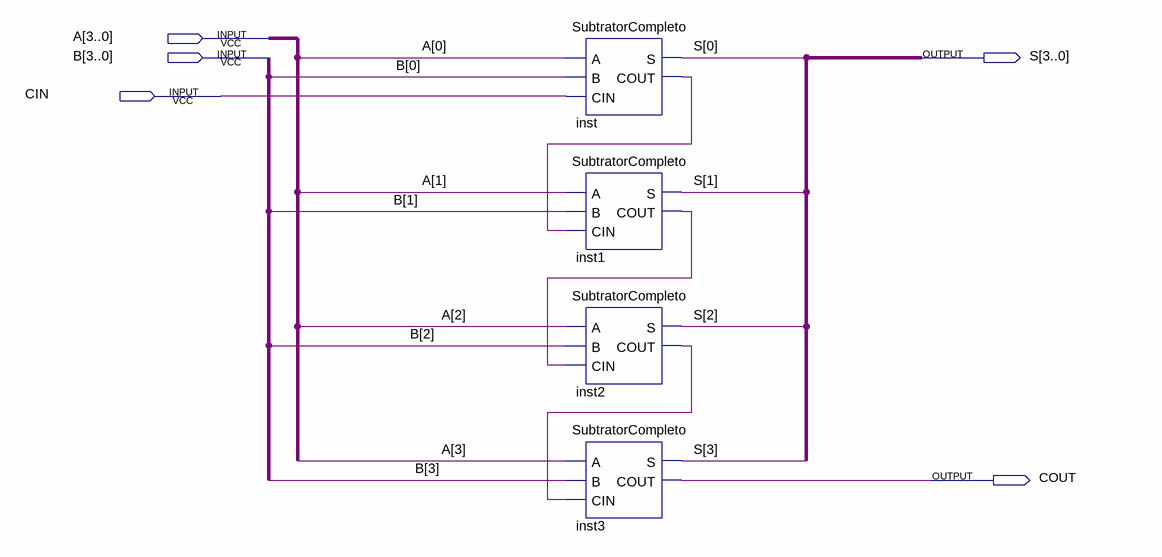
[diagram p0: schematic sheet]
// Quartus schematic Subtrator4bits.bdf as structural Verilog: 4 symbols, 5 pins
module Subtrator4bits (
  input  [3:0] A,
  input  [3:0] B,
  input  CIN,
  output [3:0] S,
  output COUT
);

  wire inst1_cout, inst2_cout, inst_cout;

  SubtratorCompleto inst (.A(A[0]), .B(B[0]), .CIN(CIN), .S(S[0]), .COUT(inst_cout));
  SubtratorCompleto inst1 (.A(A[1]), .B(B[1]), .CIN(inst_cout), .S(S[1]), .COUT(inst1_cout));
  SubtratorCompleto inst2 (.A(A[2]), .B(B[2]), .CIN(inst1_cout), .S(S[2]), .COUT(inst2_cout));
  SubtratorCompleto inst3 (.A(A[3]), .B(B[3]), .CIN(inst2_cout), .S(S[3]), .COUT(COUT));
endmodule
